# EAGLE design 301project (EAGLE 7.2.0)
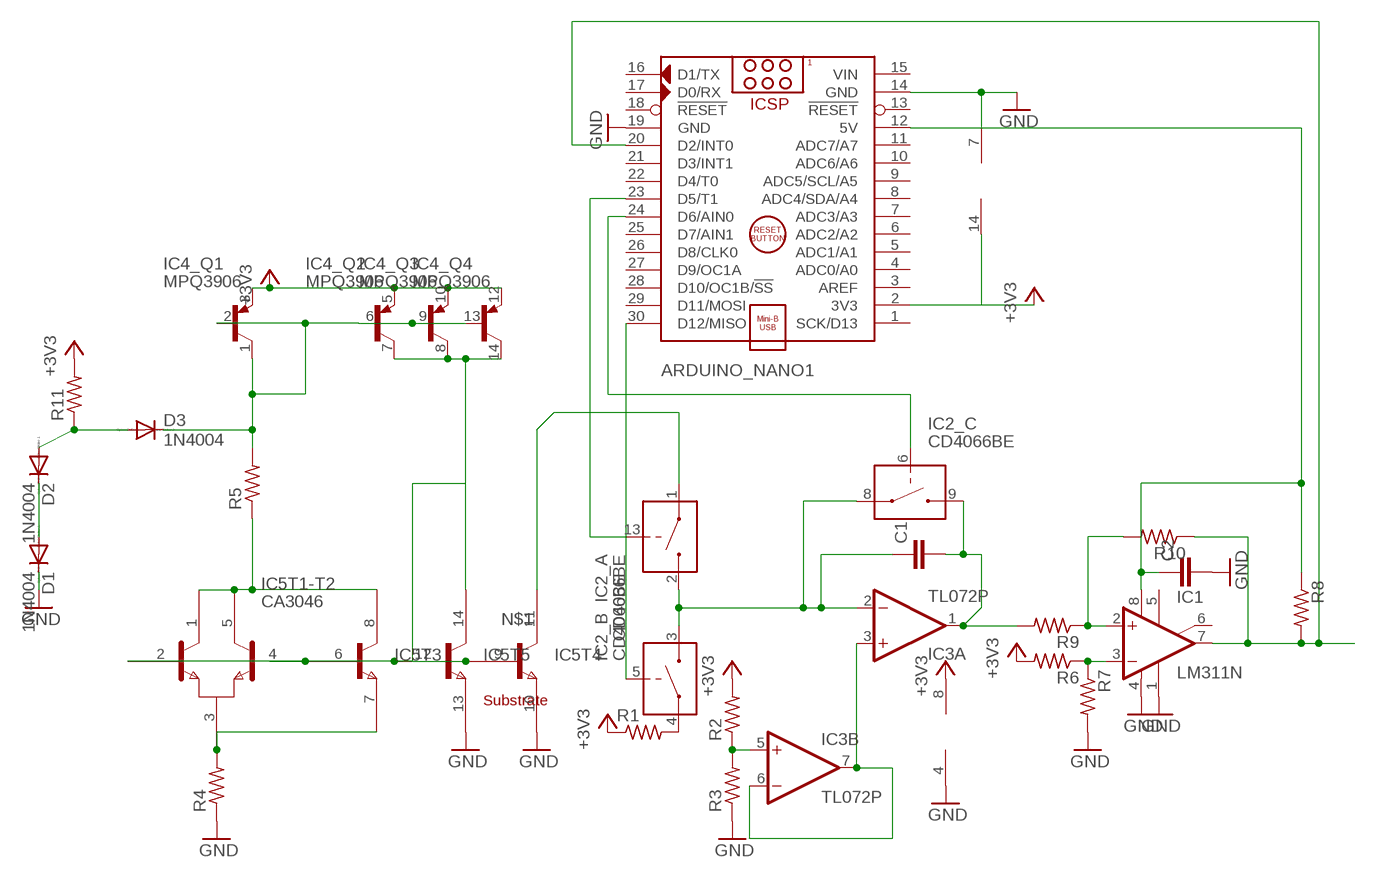
[diagram p0: schematic, sheet 1]

## Parts
ARDUINO_NANO1  ARDUINO_NANO  [ARDUINO_NANO]
C1  C5/2.5  [C5B2.5]
C2  C5/2.5  [C5B2.5]
D1  1N4004  [DO41-10]
D2  1N4004  [DO41-10]
D3  1N4004  [DO41-10]
IC1  LM311N  [DIL08]
IC2  CD4066BE  [DIL14]
IC3  TL072P  [DIL08]
IC4  MPQ3906  [DIL14]
IC5  CA3046  [DIL14]
R1  R-US_0204/7  [0204/7]
R2  R-US_0204/7  [0204/7]
R3  R-US_0204/7  [0204/7]
R4  R-US_0204/7  [0204/7]
R5  R-US_0204/7  [0204/7]
R6  R-US_0204/7  [0204/7]
R7  R-US_0204/7  [0204/7]
R8  R-US_0204/7  [0204/7]
R9  R-US_0204/7  [0204/7]
R10  R-US_0204/7  [0204/7]
R11  R-US_0204/7  [0204/7]

## Nets
+3V3: ARDUINO_NANO1.2(3V3) IC2.14(V+) IC3.8(P:V+) IC4.3(_Q1:E) IC4.5(_Q2:E) IC4.10(_Q3:E) IC4.12(_Q4:E) R1.1 R2.2 R6.2 R11.2
GND: ARDUINO_NANO1.14(GND) ARDUINO_NANO1.19(GND) C2.2 D1.C IC1.1(GND) IC1.4(V-) IC2.7(V-) IC3.4(P:V-) IC5.10(T4:E) IC5.13(T5:E) R3.1 R4.1 R7.2
N$1: IC4.7(_Q2:C) IC4.8(_Q3:C) IC4.14(_Q4:C) IC5.2(T1-T2:B1) IC5.6(T3:B) IC5.12(T5:B) IC5.14(T5:C)
N$2: C1.1 IC2.2(_A:IN/OUT2) IC2.3(_B:IN/OUT2) IC2.8(_C:IN/OUT1) IC3.2(A:-IN)
N$3: D3.C IC4.1(_Q1:C) IC4.2(_Q1:B) IC4.6(_Q2:B) IC4.9(_Q3:B) IC4.13(_Q4:B) R5.2
N$4: IC5.9(T4:B)
N$5: ARDUINO_NANO1.23(D5/T1) IC2.13(_A:CONTROL)
N$6: IC5.3(T1-T2:E) IC5.7(T3:E) R4.2
N$7: IC5.1(T1-T2:C1) IC5.5(T1-T2:C2) IC5.8(T3:C) R5.1
N$8: ARDUINO_NANO1.30(D12/MISO) IC2.5(_B:CONTROL)
N$9: IC2.1(_A:IN/OUT1) IC5.11(T4:C)
N$10: IC3.3(A:+IN) IC3.6(B:-IN) IC3.7(B:OUT)
N$11: IC2.4(_B:IN/OUT1) R1.2
N$12: IC3.5(B:+IN) R2.1 R3.2
N$13: ARDUINO_NANO1.20(D2/INT0) IC1.7(OUT) R8.2 R10.1
N$14: C1.2 IC2.9(_C:IN/OUT2) IC3.1(A:OUT) R9.2
N$15: ARDUINO_NANO1.24(D6/AIN0) IC2.6(_C:CONTROL)
N$16: IC1.3(-IN) R6.1 R7.1
N$17: D1.A D2.C
N$18: IC1.2(+IN) R9.1 R10.2
N$19: ARDUINO_NANO1.12(5V) C2.1 IC1.8(V+) R8.1
N$20: D2.A D3.A R11.1
Unconnected: ARDUINO_NANO1.1(SCK/D13) ARDUINO_NANO1.3(AREF) ARDUINO_NANO1.4(ADC0/A0) ARDUINO_NANO1.5(ADC1/A1) ARDUINO_NANO1.6(ADC2/A2) ARDUINO_NANO1.7(ADC3/A3) ARDUINO_NANO1.8(ADC4/SDA/A4) ARDUINO_NANO1.9(ADC5/SCL/A5) ARDUINO_NANO1.10(ADC6/A6) ARDUINO_NANO1.11(ADC7/A7) ARDUINO_NANO1.13(!RESET) ARDUINO_NANO1.16(D1/TX) ARDUINO_NANO1.17(D0/RX) ARDUINO_NANO1.18(!RESET) ARDUINO_NANO1.21(D3/INT1) ARDUINO_NANO1.22(D4/T0) ARDUINO_NANO1.25(D7/AIN1) ARDUINO_NANO1.26(D8/CLK0) ARDUINO_NANO1.27(D9/OC1A) ARDUINO_NANO1.28(D10/OC1B/!SS) ARDUINO_NANO1.29(D11/MOSI) IC1.5(ON) IC1.6(ON/STR) IC2.10(_D:IN/OUT2) IC2.11(_D:IN/OUT1) IC2.12(_D:CONTROL) IC5.4(T1-T2:B2)

## Power pins joined to a net without a drawn wire
VIN: ARDUINO_NANO1.15(VIN)

## Library data of the parts
ARDUINO_NANO1 = 6301-temp-sensor-rev1:ARDUINO_NANO: Arduino Nano V3.0 Module Overview: The Arduino Nano is a small, complete, and breadboard-friendly board based on the ATmega328 (Arduino Nano 3.x) or ATmega168 (Arduino Nano 2.x). It has more or less the same functionality of the Arduino Duemilanove, but in a different package. It lacks only a DC power jack, and works with a Mini-B USB cable instead of a standard one. The Nano was designed and is being produced by Gravitech <http://www.gravitech.us/arna30wiatp.html>. General specifications: Item Value Microcontroller Atmel ATmega168 or ATmega328 Operating Voltage (logic level) 5 V Input Voltage (recommended) 7-12 V Input Voltage (limits) 6-20 V Digital I/O Pins 14 (of which 6 provide PWM output) Analog Input Pins 8 DC Current per I/O Pin 40 mA Flash Memory 16 KB (ATmega168) or 32 KB (ATmega328) of which 2 KB used by bootloader SRAM 1 KB (ATmega168) or 2 KB (ATmega328) EEPROM 512 bytes (ATmega168) or 1 KB (ATmega328) Clock Speed 16 MHz Dimensions (Inches) 0.73" x 1.70" Dimensions (mm) 18mm x 45mm Overall height About 9 mm (not including pins) Weigth 5 g Power: The Arduino Nano can be powered via the Mini-B USB connection, 6-20V unregulated external power supply (pin 30), or 5V regulated external power supply (pin 27). The power source is automatically selected to the highest voltage source. Memory: The ATmega168 has 16 KB of flash memory for storing code (of which 2 KB is used for the bootloader); the ATmega328 has 32 KB, (also with 2 KB used for the bootloader). The ATmega168 has 1 KB of SRAM and 512 bytes of EEPROM (which can be read and written with the EEPROM library); the ATmega328 has 2 KB of SRAM and 1 KB of EEPROM. Input and Output: Each of the 14 digital pins on the Nano can be used as an input or output, using pinMode(), digitalWrite(), and digitalRead() functions. They operate at 5 volts. Each pin can provide or receive a maximum of 40 mA and has an internal pull-up resistor (disconnected by default) of 20-50 kOhms. In addition, some pins have specialized functions. Visit Arduino - ArduinoBoardNano <https://www.arduino.cc/en/Main/ArduinoBoardNano>
C1 C2 = capacitor-wima:C: CAPACITOR naming: grid - package width
D1-D3 = diode:1N4004: DIODE general purpose rectifier, 1 A
IC1 = 6301-temp-sensor-rev1:LM311: COMPARATOR
IC2 = 6301-temp-sensor-rev1:CD4066BE
IC3 = 6301-temp-sensor-rev1:TL072: OP AMP
IC4 = 6301-temp-sensor-rev1:MPQ3906
IC5 = synthdiy:CA3046: NPN Transistor Array
R1-R11 = resistor:R-US_: RESISTOR, American symbol

## Board
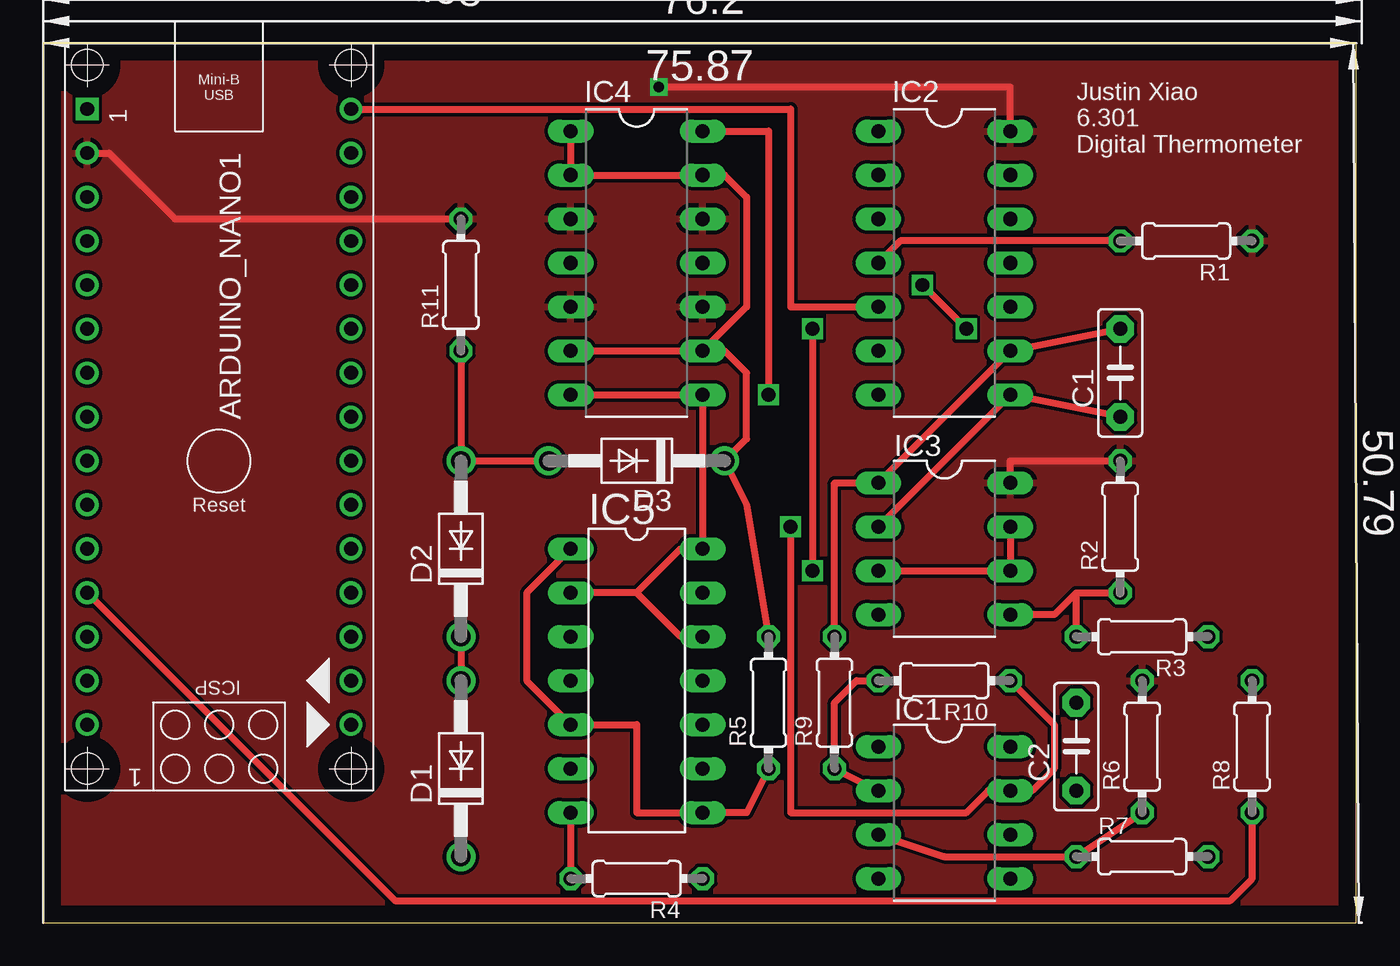
[diagram p1: board, top side]
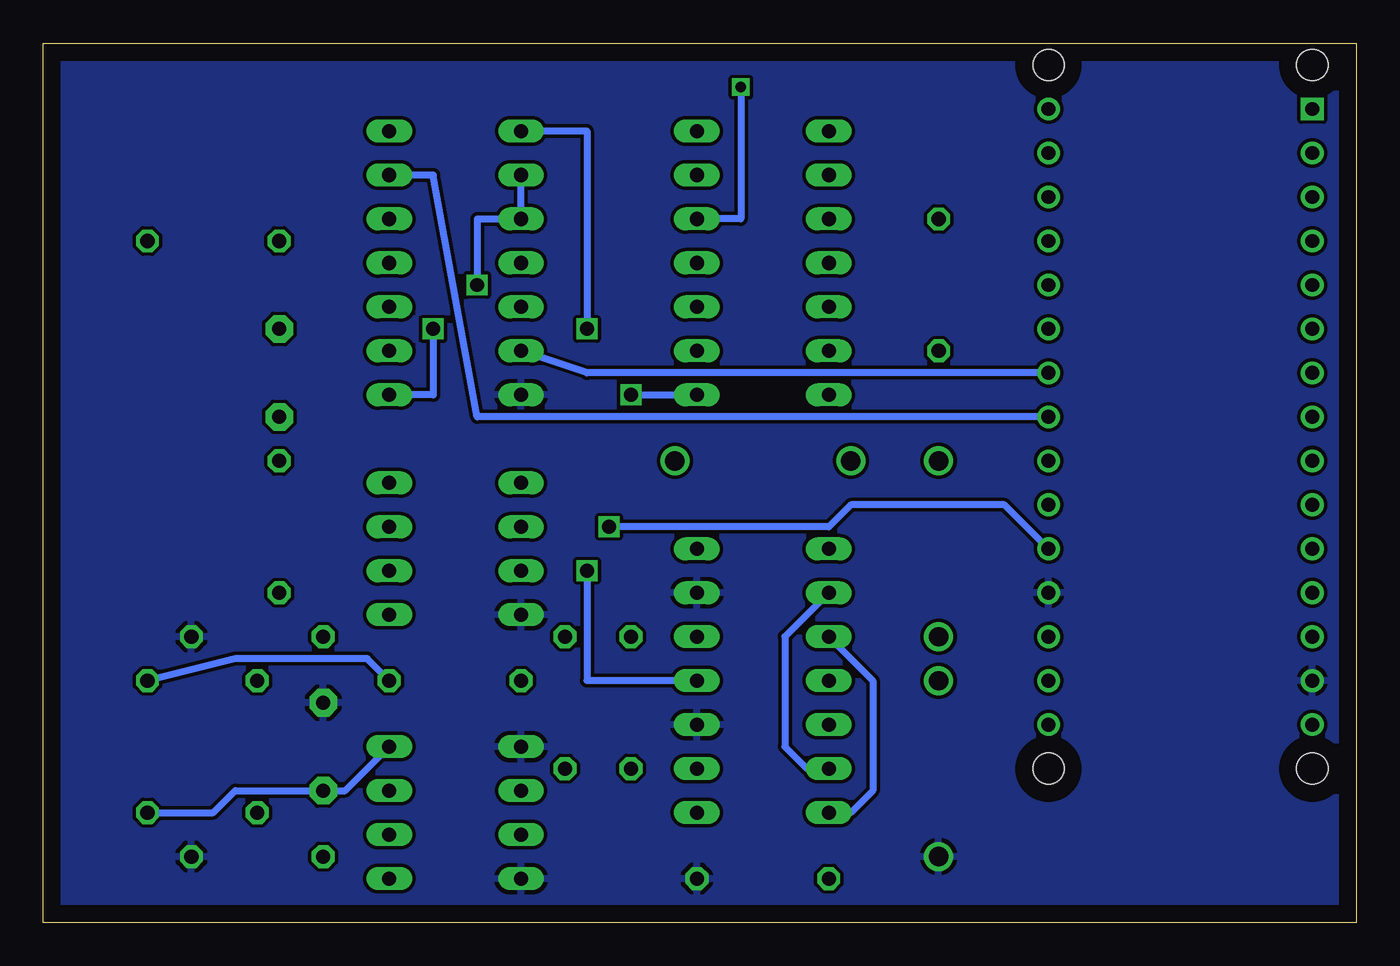
[diagram p2: board, bottom side, seen from below]

Size 75.87 x 50.79 mm. Coordinates in mm from the lower left corner, seen from the top.
Outline: 0,0 75.87,0 75.87,50.79 0,50.79 0,0
Copper layers (1*16): Top 0.035mm / dielectric 1.5mm / Bottom 0.035mm
Design rules "default": minimum track width 10mil, minimum drill 24mil, track to track 8mil, track to pad 8mil, pad to pad 8mil, via to via 8mil, smd to smd 8mil, copper to edge 40mil, drill to drill 8mil, minimum pad ring 10mil, minimum via ring 8mil, stop-mask expansion 4mil, vias tented up to drill 0mil, thermal gap 10mil

### Footprints (pad centres in the part's own frame; a part is rotated, then mirrored left to right if it is on the bottom)
ARDUINO_NANO = drill 0.8 square: 1 -20.32,-7.62 | drill 0.8: 2 -17.78,-7.62; 3 -15.24,-7.62; 4 -12.7,-7.62; 5 -10.16,-7.62; 6 -7.62,-7.62; 7 -5.08,-7.62; 8 -2.54,-7.62; 9 0,-7.62; 10 2.54,-7.62; 11 5.08,-7.62; 12 7.62,-7.62; 13 10.16,-7.62; 14 12.7,-7.62; 15 15.24,-7.62; 16 15.24,7.62; 17 12.7,7.62; 18 10.16,7.62; 19 7.62,7.62; 20 5.08,7.62; 21 2.54,7.62; 22 0,7.62; 23 -2.54,7.62; 24 -5.08,7.62; 25 -7.62,7.62; 26 -10.16,7.62; 27 -12.7,7.62; 28 -15.24,7.62; 29 -17.78,7.62; 30 -20.32,7.62 | hole 1.778: -22.86,-7.62; -22.86,7.62; 17.78,7.62; 17.78,-7.62
C5B2.5 = drill 0.813 pad 1.6 octagon: 1 -2.54,0; 2 2.54,0
DO41-10 = drill 1.118: A 5.08,0; C -5.08,0
DIL08 = drill 0.813 long: 1 -3.81,-3.81; 2 -1.27,-3.81; 3 1.27,-3.81; 4 3.81,-3.81; 5 3.81,3.81; 6 1.27,3.81; 7 -1.27,3.81; 8 -3.81,3.81
DIL14 = drill 0.813 long: 1 -7.62,-3.81; 2 -5.08,-3.81; 3 -2.54,-3.81; 4 0,-3.81; 5 2.54,-3.81; 6 5.08,-3.81; 7 7.62,-3.81; 8 7.62,3.81; 9 5.08,3.81; 10 2.54,3.81; 11 0,3.81; 12 -2.54,3.81; 13 -5.08,3.81; 14 -7.62,3.81
0204/7 = drill 0.813 octagon: 1 -3.81,0; 2 3.81,0

### Placement (x,y rotation side)
ARDUINO_NANO1  10.16,26.67 270 top
C1  62.23,31.75 90 top
C2  59.69,10.16 90 top
D1  24.13,8.89 90 top
D2  24.13,21.59 90 top
D3  34.29,26.67 180 top
IC1  52.07,6.35 270 top
IC2  52.07,38.1 270 top
IC3  52.07,21.59 270 top
IC4  34.29,38.1 270 top
IC5  34.29,13.97 270 top
R1  66.04,39.37 180 top
R2  62.23,22.86 90 top
R3  63.5,16.51 180 top
R4  34.29,2.54 180 top
R5  41.91,12.7 90 top
R6  63.5,10.16 90 top
R7  63.5,3.81 0 top
R8  69.85,10.16 90 top
R9  45.72,12.7 90 top
R10  52.07,13.97 180 top
R11  24.13,36.83 90 top

### Tracks (layer width: path | path; a pad name or v marks a point on that pad's centre or on a via)
+3V3  (via drill 0.6)
  Top 0.406: ARDUINO_NANO1.2 3.81,44.45 7.62,40.64 R11.2 | IC3.8 55.88,26.67 R2.2 | IC2.14 55.88,48.26 v35.56,48.26
  Bottom 0.406: v35.56,48.26 35.56,40.64 IC4.12
  pour Top: 0,50.8 76.2,50.8 76.2,0 0,0
GND
  pour Bottom: 76.2,0 0,0 0,50.8 76.2,50.8
N$1  (via drill 0.8)
  Top 0.406: IC4.7 IC4.8 IC5.14 36.83,21.59 34.29,19.05 | IC4.14 41.91,45.72 v41.91,30.48 | 34.29,19.05 IC5.2 | IC5.12 36.83,16.51 34.29,19.05
  Bottom 0.406: v41.91,30.48 IC4.8 | IC5.2 33.02,16.51 33.02,10.16 31.75,8.89 IC5.6
N$2  (via drill 0.8)
  Top 0.406: IC3.2 IC2.8 C1.1 | v50.8,36.83 v53.34,34.29
  Bottom 0.406: IC2.2 IC2.3 50.8,40.64 v50.8,36.83 | v53.34,34.29 53.34,30.48 IC2.8
N$3
  Top 0.406: IC4.9 39.37,33.02 40.64,31.75 40.64,27.94 D3.C 40.64,24.13 R5.2 | IC4.6 IC4.9 | IC4.1 IC4.2 IC4.13 39.37,43.18 40.64,41.91 40.64,35.56 IC4.9
N$5
  Bottom 0.406: ARDUINO_NANO1.23 50.8,29.21 53.34,43.18 IC2.13
N$6
  Top 0.406: IC5.7 R4.2
  Bottom 0.406: IC5.3 27.94,13.97 27.94,7.62 29.21,6.35 IC5.7
N$7
  Top 0.406: R5.1 40.64,6.35 IC5.8 34.29,6.35 34.29,11.43 IC5.5 27.94,13.97 27.94,19.05 IC5.1
N$8
  Top 0.406: ARDUINO_NANO1.30 43.18,46.99 43.18,35.56 IC2.5
N$9  (via drill 0.8)
  Top 0.406: v44.45,34.29 v44.45,20.32
  Bottom 0.406: IC5.11 44.45,13.97 v44.45,20.32 | IC2.1 44.45,45.72 v44.45,34.29
N$10
  Top 0.406: IC3.3 IC3.6 IC3.7
N$11
  Top 0.406: R1.2 49.53,39.37 IC2.4
N$12
  Top 0.406: R3.2 59.69,19.05 | 59.69,19.05 R2.1 | 59.69,19.05 58.42,17.78 IC3.5
N$13  (via drill 0.8)
  Top 0.406: R10.1 58.42,11.43 58.42,8.89 57.15,7.62 IC1.7 54.61,7.62 53.34,6.35 43.18,6.35 v43.18,22.86
  Bottom 0.406: ARDUINO_NANO1.20 20.32,24.13 29.21,24.13 30.48,22.86 v43.18,22.86 | R10.1 57.15,15.24 64.77,15.24 R8.2
N$14
  Top 0.406: R9.2 45.72,25.4 IC3.1 IC2.9 C1.2
N$15
  Bottom 0.406: ARDUINO_NANO1.24 44.45,31.75 IC2.6
N$16
  Top 0.406: IC1.3 52.07,3.81 R7.1 R6.1
N$17
  Top 0.406: D2.C D1.A 24.13,12.7
N$18
  Top 0.406: IC1.2 R9.1 45.72,12.7 46.99,13.97 R10.2
N$19
  Top 0.406: ARDUINO_NANO1.12 20.32,1.27 68.58,1.27 69.85,2.54 R8.1
  Bottom 0.406: R8.1 66.04,6.35 64.77,7.62 C2.1 58.42,7.62 IC1.8
N$20
  Top 0.406: D3.A D2.A R11.1

### Text on the board
tPlace: Justin Xiao / 6.301 / Digital Thermometer